# Altium schematic sheet Power System.SchDoc
size 420 x 297 mm; Address1: Address1; Address2: Address2; Address3: Address3; Address4: Address4; DocumentNumber: АБВГ.123456.001 Э3; SheetNumber: 1; Scale: 1:1; DocumentType: Схема электрическая принципиальная; FirstReferrence: АБВГ.123456.001
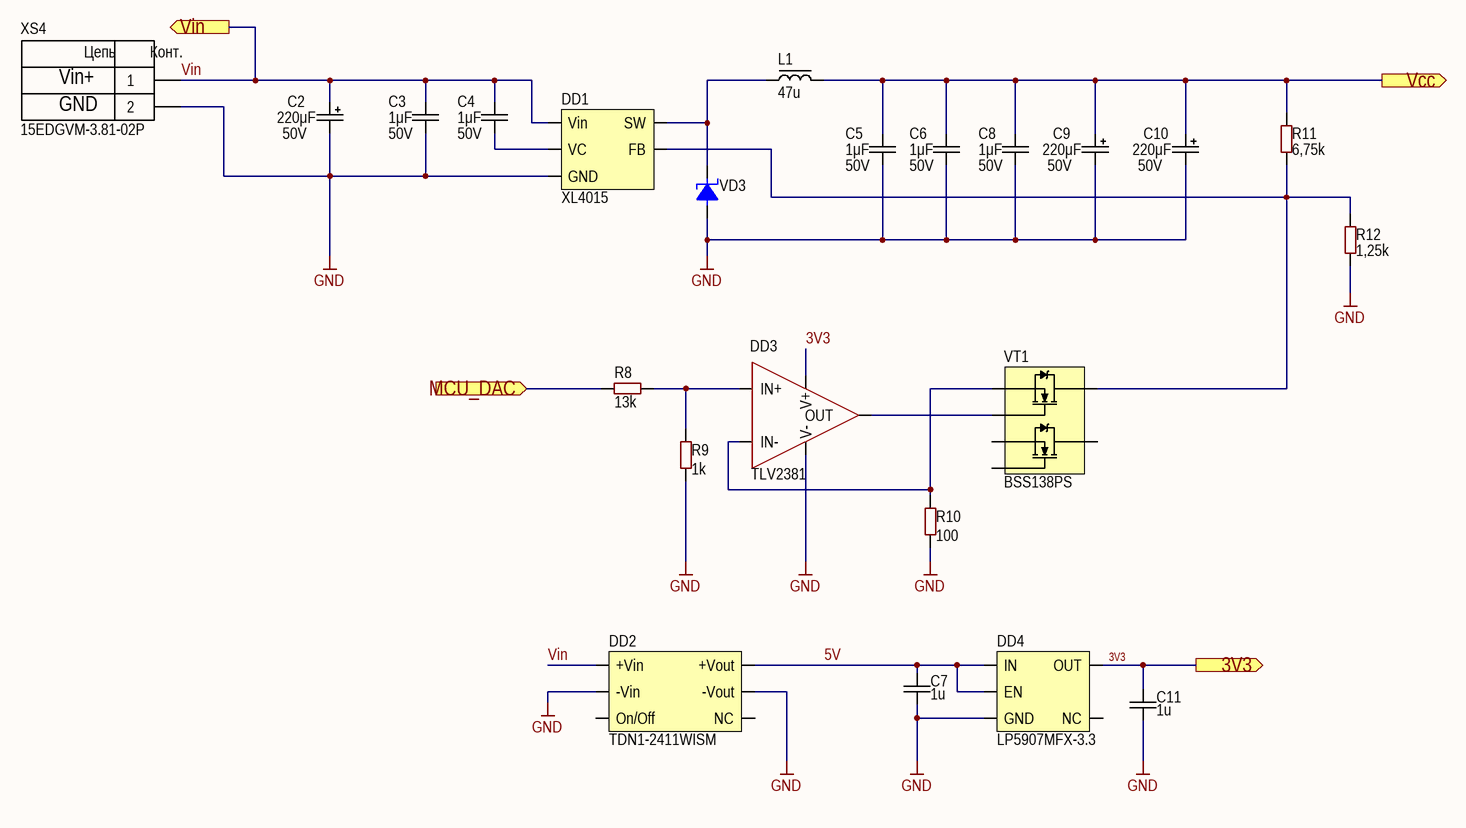
[diagram p0: Power System.SchDoc]

## Parts
C2  value 220μF  Voltage: 50V  [CAP: SMD-G Package(10x10)]
C3  value 1μF  Voltage: 50V  [CAP: 0805]
C4  value 1μF  Voltage: 50V  [CAP: 0805]
C5  value 1μF  Voltage: 50V  [CAP: 0805]
C6  value 1μF  Voltage: 50V  [CAP: 0805]
C7  value 1u  [CAP: 0603]
C8  value 1μF  Voltage: 50V  [CAP: 0805]
C9  value 220μF  Voltage: 50V  [CAP: SMD-G Package(10x10)]
C10  value 220μF  Voltage: 50V  [CAP: SMD-G Package(10x10)]
C11  value 1u  [CAP: 0603]
DD1  XL4015  [TO263-5L]
DD2  TDN1-2411WISM  [TDN1-2411WISM]
DD3  TLV2381  [SOT23-5]
DD4  LP5907MFX-3.3  [SOT23-5]
L1  47u  [IND: HM]
R8  value 13k  [RES: 0603]
R9  value 1k  [RES: 0603]
R10  value 100  [RES: 0603]
R11  value 6,75k  [RES: 0603]
R12  value 1,25k  [RES: 0603]
VD3  STPS1045DEE  [PowerFLAT(3.3x3.3)]  (value not drawn)
VT1  BSS138PS  [SOT363]
XS4  15EDGVM-3.81-02P  [CON: 15EDGVM-3.81-02P]

## Ports
3V3 (out), MCU_DAC (in), Vcc (out), Vin (out)

## Nets
GND: C2.2 C3.1 C5.1 C6.1 C7.1 C8.1 C9.2 C10.2 C11.1 DD1.1(GND) DD2.2(-Vin) DD2.6(-Vout) DD3.2(V-) DD4.2(GND) R9.2 R10.2 R12.1 VD3.1 XS4.2
3V3: C11.2 DD3.5(V+) DD4.5(OUT) ; port 3V3
5V: C7.2 DD2.7(+Vout) DD4.1(IN) DD4.3(EN)
MCU_DAC: R8.2 ; port MCU_DAC
Vcc: C5.2 C6.2 C8.2 C9.1 C10.1 L1.2 R11.2 ; port Vcc
Vin: C2.1 C3.2 C4.2 DD1.5(Vin) DD2.1(+Vin) XS4.1 ; port Vin
NetC4_1: C4.1 DD1.4(VC)
NetDD1_2: DD1.2(FB) R11.1 R12.2 VT1.6(D1)
NetDD1_3: DD1.3(SW) L1.1 VD3.2
NetDD3_1: DD3.1(OUT) VT1.2(G1)
NetDD3_3: DD3.3(IN+) R8.1 R9.1
NetDD3_4: DD3.4(IN-) R10.1 VT1.1(S1)

Not connected (* = marked no-connect by the designer): DD2 4(On/Off) 5(NC); DD4 4(NC); VT1 3(D2) 4(S2) 5(G2)

## Notes on the sheet
- (near XS4) Vin+
- GND
- Перв. примен.
- Справ. №
- Подп. и дата
- Инв. № дубл.
- Взам. инв. №
- Разраб.
- Изм.
- Лист
- № докум.
- Подп.
- Дата
- Лит.
- Масса
- Масштаб
- Пров.
- Т.контр.
- Листов
- Инв. № подл.
- Утв.
- Н.контр.
- 2.106-A3
- Копировал
- Формат А3
- (in symbol 15EDGVM-3.81-02P) Цепь; Конт.

## Library data of the parts
C2 C9 C10 = Aluminium
C3-C6 C8 = Ceramic_0805: Manufacturer: Yageo; PartNumber: CC0805KRX7R7BB104; ValueManufacturerPartNumber: Ceramic capacitor, 1μF, X7R, ±10%, 50V, 0805, -55...+125°C; TypeCapacitor: Ceramic capacitor; Tolerance: ±10%; TypeDielectric: X7R; Package: 0805; HelpURL: https://www.digikey.com/product-detail/en/yageo/CC0805KRX7R7BB104/311-1142-1-ND/303052; Temperature: -55...+125°C
C7 C11 = Ceramic_0603: Manufacturer: Yageo; PartNumber: CC0603KRX7R7BB104; ValueManufacturerPartNumber: Ceramic capacitor, 1u, X7R, ±10%, 16V, 0603, -55...+125°C; TypeCapacitor: Ceramic capacitor; Tolerance: ±10%; TypeDielectric: X7R; Voltage: 16V; Package: 0603; HelpURL: https://www.digikey.com/product-detail/en/yageo/CC0603KRX7R7BB104/311-1088-1-ND/302998; Temperature: -55...+125°C
DD1 = XL4015: Buck DC-DC; ComponentLink1Description: Datasheet; ComponentLink1URL: http://www.xlsemi.com/datasheet/xl4015%20datasheet.pdf
DD2 = TDN1-2411WISM: DC-DC converter; ComponentLink1Description: Datasheet; ComponentLink1URL: https://www.tracopower.com/int/ru/model/tdn-1-2411wism
DD3 = TLV2381: OPAmp; ComponentLink1Description: Datasheet; ComponentLink1URL: https://www.ti.com/lit/ds/symlink/tlv2382.pdf?ts=1631189776503&ref_url=https%253A%252F%252Fwww.google.com%252F
DD4 = LP5907MFX-3.3: LDO 250 mA; ComponentLink1Description: Datasheet; ComponentLink1URL: https://www.ti.com/lit/ds/symlink/lp5907.pdf?ts=1629438025263&ref_url=https%253A%252F%252Fwww.google.com%252F
L1 = Inductor(HM)
R8 = Resistor_0603: Manufacturer: Yageo; PartNumber: RC0603JR-07100RL; ValueManufacturerPartNumber: Resistor film, 13k, ±5%, 0603, 0.1W, -55...+125°C; TypeResistor: Resistor film; Power: 0.1W; Tolerance: ±5%; Package: 0603; HelpURL: https://www.digikey.com/product-detail/en/yageo/RC0603JR-07100RL/311-100GRCT-ND/729644; Temperature: -55...+125°C
R9 = Resistor_0603: Manufacturer: Yageo; PartNumber: RC0603JR-07100RL; ValueManufacturerPartNumber: Resistor film, 1k, ±5%, 0603, 0.1W, -55...+125°C; TypeResistor: Resistor film; Power: 0.1W; Tolerance: ±5%; Package: 0603; HelpURL: https://www.digikey.com/product-detail/en/yageo/RC0603JR-07100RL/311-100GRCT-ND/729644; Temperature: -55...+125°C
R10 = Resistor_0603: Manufacturer: Yageo; PartNumber: RC0603JR-07100RL; ValueManufacturerPartNumber: Resistor film, 100, ±5%, 0603, 0.1W, -55...+125°C; TypeResistor: Resistor film; Power: 0.1W; Tolerance: ±5%; Package: 0603; HelpURL: https://www.digikey.com/product-detail/en/yageo/RC0603JR-07100RL/311-100GRCT-ND/729644; Temperature: -55...+125°C
R11 = Resistor_0603: Manufacturer: Yageo; PartNumber: RC0603JR-07100RL; ValueManufacturerPartNumber: Resistor film, 6,75k, ±5%, 0603, 0.1W, -55...+125°C; TypeResistor: Resistor film; Power: 0.1W; Tolerance: ±5%; Package: 0603; HelpURL: https://www.digikey.com/product-detail/en/yageo/RC0603JR-07100RL/311-100GRCT-ND/729644; Temperature: -55...+125°C
R12 = Resistor_0603: Manufacturer: Yageo; PartNumber: RC0603JR-07100RL; ValueManufacturerPartNumber: Resistor film, 1,25k, ±5%, 0603, 0.1W, -55...+125°C; TypeResistor: Resistor film; Power: 0.1W; Tolerance: ±5%; Package: 0603; HelpURL: https://www.digikey.com/product-detail/en/yageo/RC0603JR-07100RL/311-100GRCT-ND/729644; Temperature: -55...+125°C
VD3 = STPS1045DEE: 45V,10A Schottky; ComponentLink1Description: Datasheet; ComponentLink1URL: https://www.st.com/en/diodes-and-rectifiers/stps1045dee.html
VT1 = BSS138PS: ComponentLink1Description: Datasheet; ComponentLink1URL: https://assets.nexperia.com/documents/data-sheet/BSS138PS.pdf
XS4 = 15EDGVM-3.81-02P: ComponentLink1Description: Datasheet; ComponentLink1URL: http://files.xn--e1agecchai.xn--p1ai/pdf/15edgvm-3.81.pdf